# EAGLE design pink-0 (EAGLE 7.3.0)
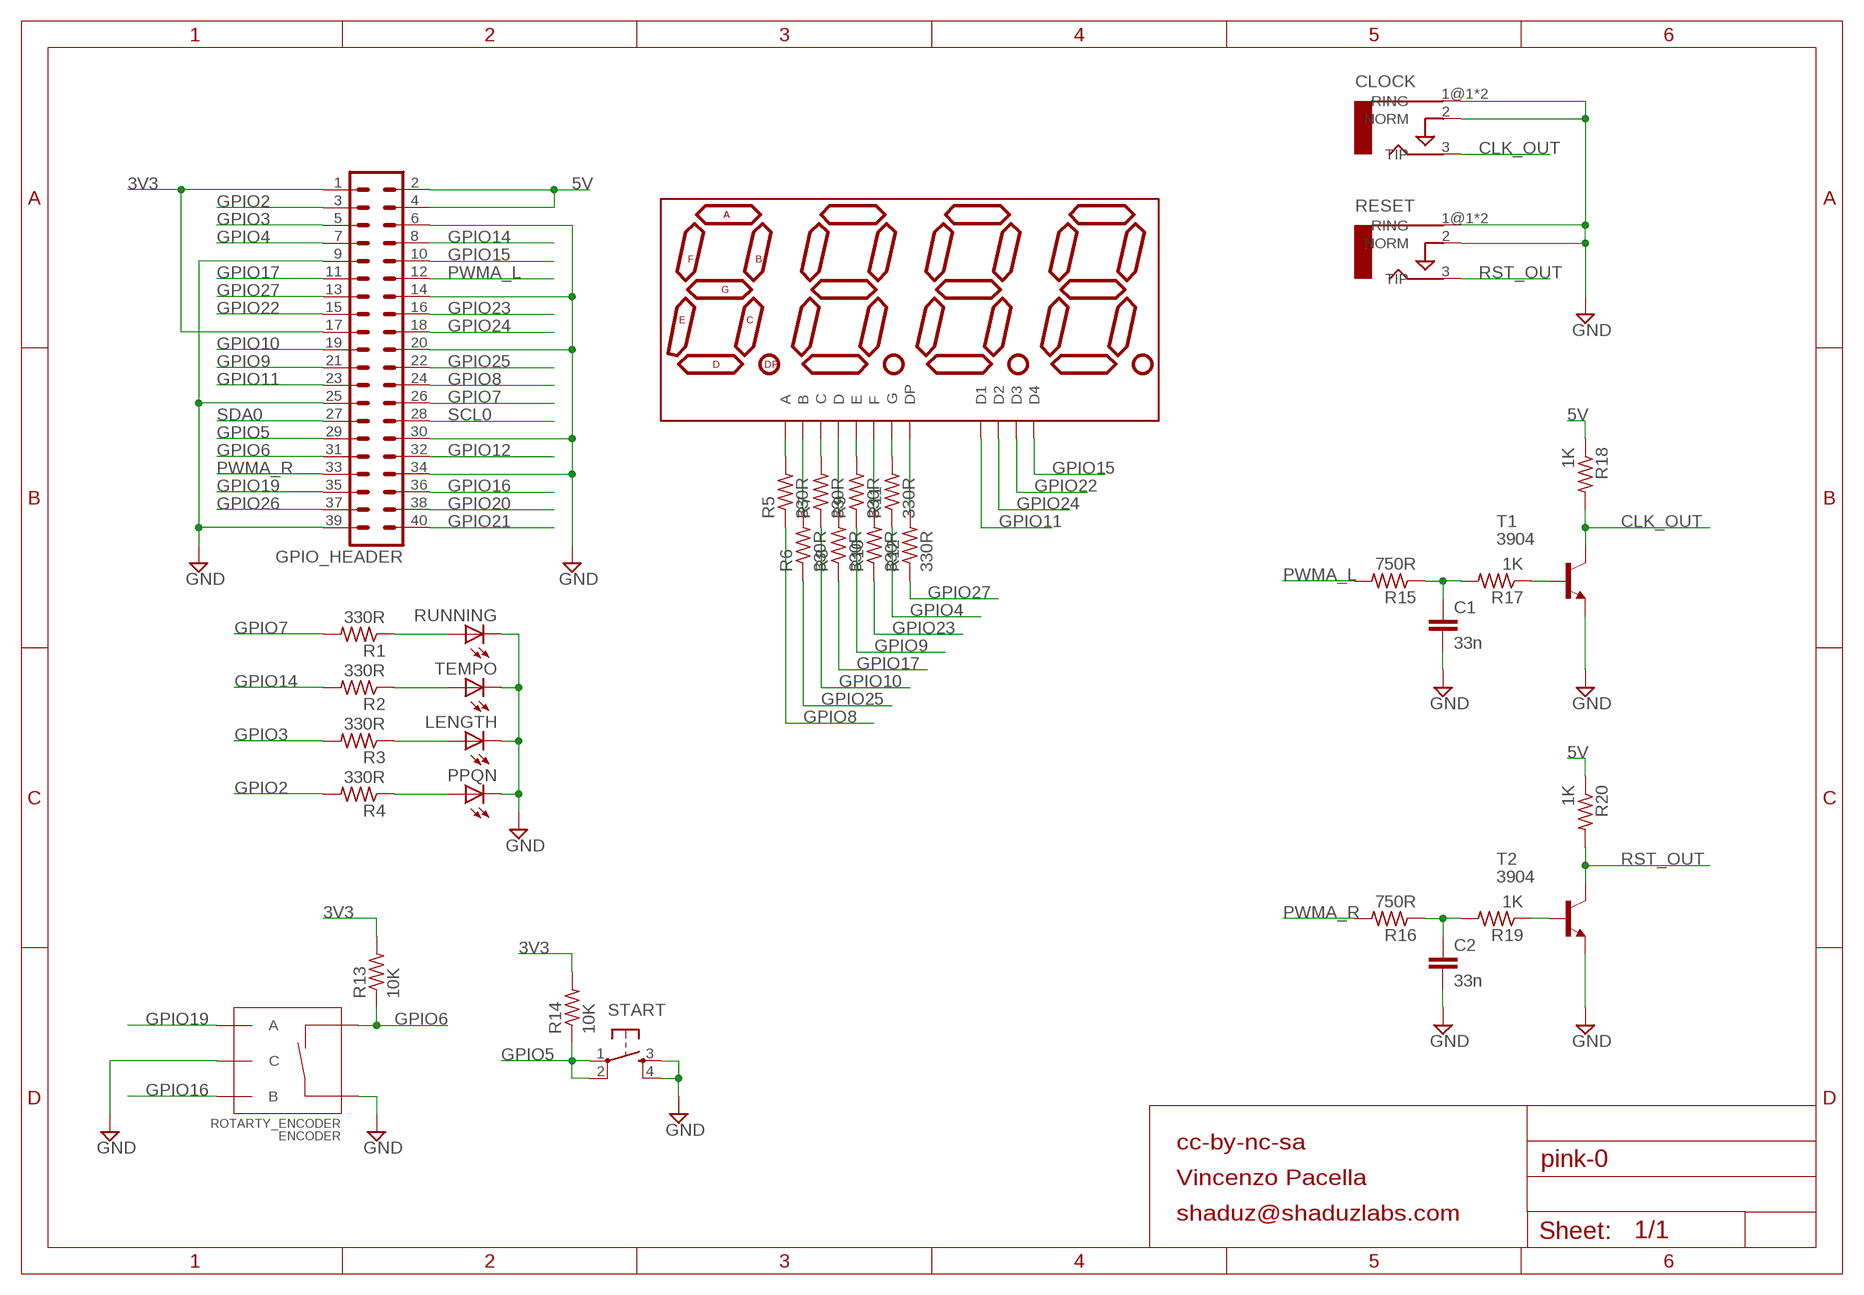
[diagram p0: schematic, sheet 1]

## Parts
C1  33n  CAP0603-CAP  [0603-CAP]
C2  33n  CAP0603-CAP  [0603-CAP]
CLOCK  AUDIO-JACKERTHENVAR  [ERTHENVAR-JACK]
DISP1  QDSP6064  7-SEGMENT-4DIGIT-COUNTER-HP-BUBBLE  [DIL12]
ENCODER  ROTARTY_ENCODER  [ROTARY_ENC_PLAIN]
GPIO_HEADER  PIZERO_THROUGH_HOLE  [PIZERO_THOUGH_HOLE]
LENGTH  LED0603  [LED-0603]
PPQN  LED0603  [LED-0603]
R1  330R  R-US_R0402  [R0402]
R2  330R  R-US_R0402  [R0402]
R3  330R  R-US_R0402  [R0402]
R4  330R  R-US_R0402  [R0402]
R5  330R  R-US_R0402  [R0402]
R6  330R  R-US_R0402  [R0402]
R7  330R  R-US_R0402  [R0402]
R8  330R  R-US_R0402  [R0402]
R9  330R  R-US_R0402  [R0402]
R10  330R  R-US_R0402  [R0402]
R11  330R  R-US_R0402  [R0402]
R12  330R  R-US_R0402  [R0402]
R13  10K  R-US_R0402  [R0402]
R14  10K  R-US_R0402  [R0402]
R15  750R  R-US_R0402  [R0402]
R16  750R  R-US_R0402  [R0402]
R17  1K  R-US_R0402  [R0402]
R18  1K  R-US_R0402  [R0402]
R19  1K  R-US_R0402  [R0402]
R20  1K  R-US_R0402  [R0402]
RESET  AUDIO-JACKERTHENVAR  [ERTHENVAR-JACK]
RUNNING  LED0603  [LED-0603]
START  TAC_SWITCHPTH  [TACTILE-PTH]
T1  3904  MMBT3904LT1-NPN-SOT23-BEC  [SOT23-BEC]
T2  3904  MMBT3904LT1-NPN-SOT23-BEC  [SOT23-BEC]
TEMPO  LED0603  [LED-0603]

## Nets
3V3: GPIO_HEADER.1 GPIO_HEADER.17 R13.2 R14.2
5V: GPIO_HEADER.2 GPIO_HEADER.4 R18.1 R20.1
CLK_OUT: CLOCK.3(TIP) R18.2 T1.C
GND: C1.2 C2.2 CLOCK.1@1(RING) CLOCK.1@2(RING) CLOCK.2(NORM) ENCODER.C ENCODER.SW+ GPIO_HEADER.6 GPIO_HEADER.9 GPIO_HEADER.14 GPIO_HEADER.20 GPIO_HEADER.25 GPIO_HEADER.30 GPIO_HEADER.34 GPIO_HEADER.39 LENGTH.C PPQN.C RESET.1@1(RING) RESET.1@2(RING) RESET.2(NORM) RUNNING.C START.3 START.4 T1.E T2.E TEMPO.C
GPIO2: GPIO_HEADER.3 R4.2
GPIO3: GPIO_HEADER.5 R3.2
GPIO4: GPIO_HEADER.7 R11.1
GPIO5: GPIO_HEADER.29 R14.1 START.1 START.2
GPIO6: ENCODER.SW- GPIO_HEADER.31 R13.1
GPIO7: GPIO_HEADER.26 R1.2
GPIO8: GPIO_HEADER.24 R5.1
GPIO9: GPIO_HEADER.21 R9.1
GPIO10: GPIO_HEADER.19 R7.1
GPIO11: DISP1.1(D1) GPIO_HEADER.23
GPIO12: GPIO_HEADER.32
GPIO14: GPIO_HEADER.8 R2.2
GPIO15: DISP1.6(D4) GPIO_HEADER.10
GPIO16: ENCODER.B GPIO_HEADER.36
GPIO17: GPIO_HEADER.11 R8.1
GPIO19: ENCODER.A GPIO_HEADER.35
GPIO20: GPIO_HEADER.38
GPIO21: GPIO_HEADER.40
GPIO22: DISP1.4(D3) GPIO_HEADER.15
GPIO23: GPIO_HEADER.16 R10.1
GPIO24: DISP1.10(D2) GPIO_HEADER.18
GPIO25: GPIO_HEADER.22 R6.1
GPIO26: GPIO_HEADER.37
GPIO27: GPIO_HEADER.13 R12.1
N$1: DISP1.12(A) R5.2
N$2: DISP1.11(B) R6.2
N$3: DISP1.3(C) R7.2
N$4: DISP1.8(D) R8.2
N$5: R1.1 RUNNING.A
N$6: R2.1 TEMPO.A
N$7: DISP1.2(E) R9.2
N$8: DISP1.9(F) R10.2
N$9: DISP1.7(G) R11.2
N$10: DISP1.5(DP) R12.2
N$13: R19.1 T2.B
N$14: R17.1 T1.B
N$25: C1.1 R15.1 R17.2
N$26: LENGTH.A R3.1
N$27: PPQN.A R4.1
N$32: C2.1 R16.1 R19.2
PWMA_L: GPIO_HEADER.12 R15.2
PWMA_R: GPIO_HEADER.33 R16.2
RST_OUT: R20.2 RESET.3(TIP) T2.C
SCL0: GPIO_HEADER.28
SDA0: GPIO_HEADER.27

## Notes on the sheet
- cc-by-nc-sa
- Vincenzo Pacella
- shaduz@shaduzlabs.com

## Library data of the parts
C1 C2 = SparkFun-Capacitors:CAP: Capacitor Standard 0603 ceramic capacitor, and 0.1" leaded capacitor.
CLOCK RESET = erthenvar:AUDIO-JACK: Switching Mono 3.5mm Audio Jack from Erthenvar.
DISP1 = SparkFun-Displays:7-SEGMENT-4DIGIT-COUNTER; STOREFRONT: COM-12710
ENCODER = SparkFun-Electromechanical:ROTARTY_ENCODER: Simple no LED rotary encoder Example: COM-09117
GPIO_HEADER = pizero:PIZERO_THROUGH_HOLE
LENGTH PPQN RUNNING TEMPO = SparkFun-LED:LED: LEDs Standard schematic elements and footprints for 5mm, 3mm, 1206, and 0603 sized LEDs. 5mm - Spark Fun Electronics SKU : COM-00529 (and others)
R1-R20 = resistor:R-US_: RESISTOR, American symbol
START = SparkFun-Electromechanical:TAC_SWITCH: Momentary Switch Button commonly used for reset or general input. Spark Fun Electronics SKU : COM-00097 SMT- SWCH-08247
T1 T2 = transistor:*-NPN-: NPN Transistror BF959 corrected 2008.03.06

## Board
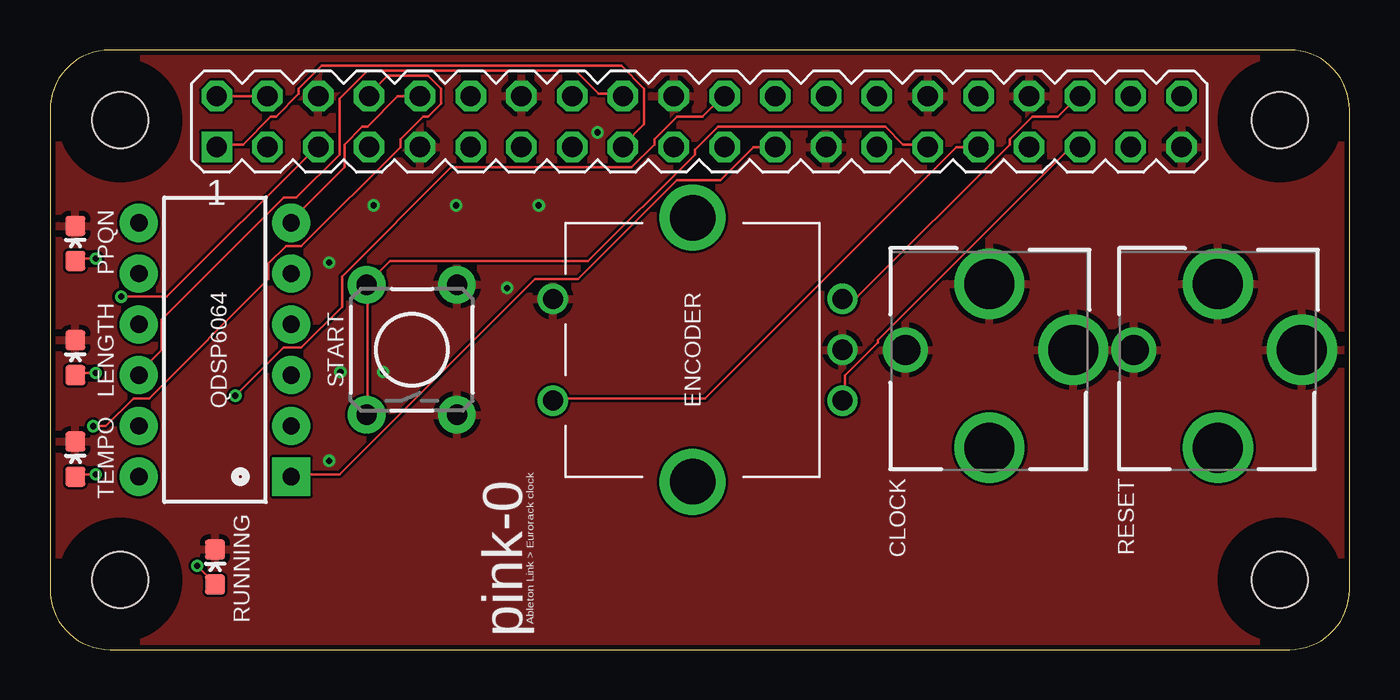
[diagram p1: board, top side]
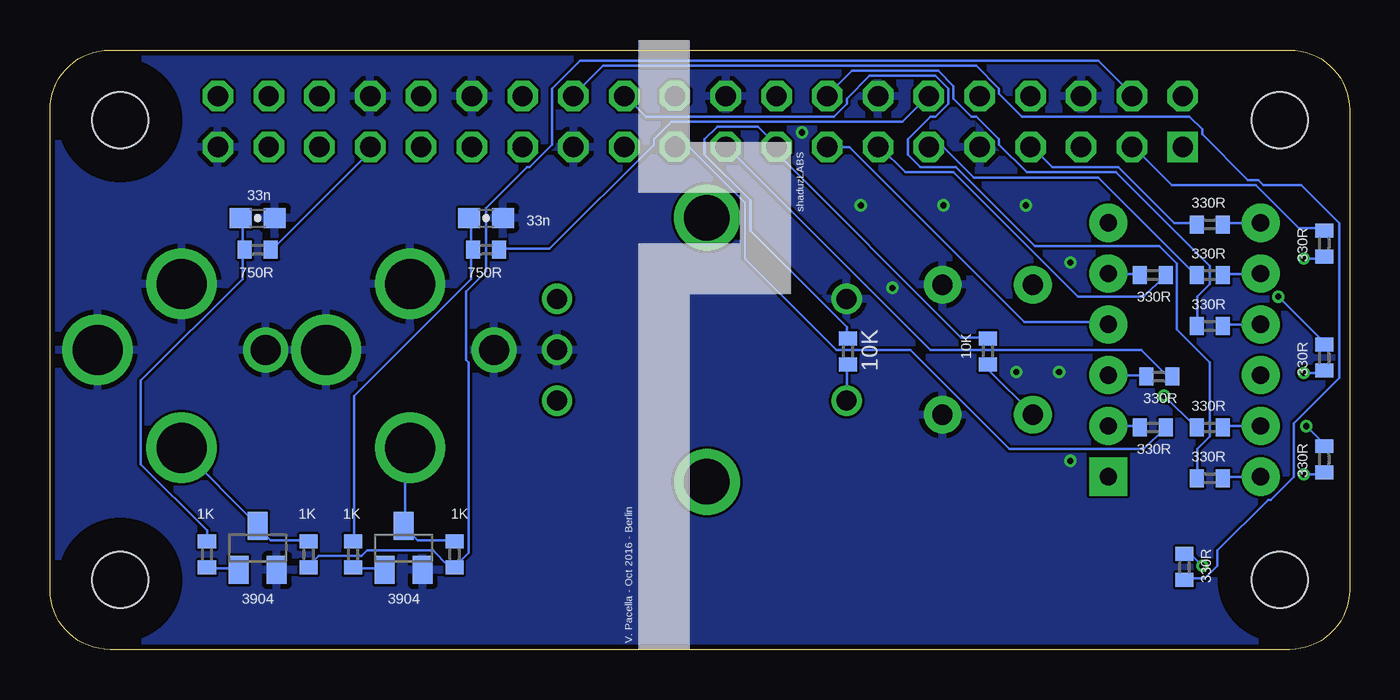
[diagram p2: board, bottom side, seen from below]

Size 65 x 30 mm. Coordinates in mm from the lower left corner, seen from the top.
Copper layers (1*16): Top 0.035mm / dielectric 1.5mm / Bottom 0.035mm
Design rules "MF_Standard_2_Layer": minimum track width 5mil, minimum drill 12mil, track to track 5mil, track to pad 5mil, pad to pad 5mil, via to via 5mil, smd to smd 0mil, copper to edge 10mil, drill to drill 10mil, minimum pad ring 6mil, minimum via ring 6mil, stop-mask expansion 2mil, vias tented up to drill 25mil, thermal gap 10mil

### Footprints (pad centres in the part's own frame; a part is rotated, then mirrored left to right if it is on the bottom)
0603-CAP = smd 1.1 x 1: 1 -0.85,0; 2 0.85,0
ERTHENVAR-JACK = drill 2.5: 1@1 -4.2,0; 2 0,-3.3; 3 0,4.9 | drill 1.5: 1@2 4.2,0
DIL12 = drill 0.864 pad 1.905 square: 1 -6.35,-3.81 | drill 0.864 pad 1.905: 2 -3.81,-3.81; 3 -1.27,-3.81; 4 1.27,-3.81; 5 3.81,-3.81; 6 6.35,-3.81; 7 6.35,3.81; 8 3.81,3.81; 9 1.27,3.81; 10 -1.27,3.81; 11 -3.81,3.81; 12 -6.35,3.81
ROTARY_ENC_PLAIN = drill 1.016: A 7.493,-2.54; B 7.493,2.54; C 7.493,0; SW+ -6.985,2.54; SW- -6.985,-2.54 | drill 2.286: P$3 0,6.604; P$4 0,-6.604
PIZERO_THOUGH_HOLE = drill 1.016 square: 1 8.34,25.15 | drill 1.016 octagon: 2 8.34,27.69; 3 10.88,25.15; 4 10.88,27.69; 5 13.42,25.15; 6 13.42,27.69; 7 15.96,25.15; 8 15.96,27.69; 9 18.5,25.15; 10 18.5,27.69; 11 21.04,25.15; 12 21.04,27.69; 13 23.58,25.15; 14 23.58,27.69; 15 26.12,25.15; 16 26.12,27.69; 17 28.66,25.15; 18 28.66,27.69; 19 31.2,25.15; 20 31.2,27.69; 21 33.74,25.15; 22 33.74,27.69; 23 36.28,25.15; 24 36.28,27.69; 25 38.82,25.15; 26 38.82,27.69; 27 41.36,25.15; 28 41.36,27.69; 29 43.9,25.15; 30 43.9,27.69; 31 46.44,25.15; 32 46.44,27.69; 33 48.98,25.15; 34 48.98,27.69; 35 51.52,25.15; 36 51.52,27.69; 37 54.06,25.15; 38 54.06,27.69; 39 56.6,25.15; 40 56.6,27.69 | hole 2.8: 3.5,3.5; 3.5,26.5; 61.5,26.5; 61.5,3.5
LED-0603 = smd 1 x 1: A 0,-0.877; C 0,0.877
R0402 = smd 0.7 x 0.9: 1 -0.65,0; 2 0.65,0
TACTILE-PTH = drill 1.016 pad 1.88: 1 -3.251,2.261; 2 3.251,2.261; 3 -3.251,-2.261; 4 3.251,-2.261
SOT23-BEC = smd 1 x 1.4: B -0.95,-1.1; C 0,1.1; E 0.95,-1.1

### Placement (x,y rotation side)
C1  43.18,21.59 0 bottom
C2  54.61,21.59 0 bottom
CLOCK  46.99,15 180 top
DISP1  8.26,15 90 top
ENCODER  32.14,15 0 top
GPIO_HEADER  0,0 0 top
LENGTH  1.27,14.61 0 top
PPQN  1.27,20.32 0 top
R1  8.26,4.13 270 bottom
R2  1.27,9.53 90 bottom
R3  1.27,14.61 90 bottom
R4  1.27,20.32 90 bottom
R5  6.99,8.57 0 bottom
R6  6.99,11.11 0 bottom
R7  9.53,13.65 180 bottom
R8  6.99,18.73 0 bottom
R9  9.84,11.11 180 bottom
R10  6.99,16.19 0 bottom
R11  6.99,21.27 0 bottom
R12  9.84,18.73 180 bottom
R13  25.08,14.92 90 bottom
R14  18.1,14.92 90 bottom
R15  43.18,20 0 bottom
R16  54.61,20 0 bottom
R17  49.85,4.76 90 bottom
R18  44.77,4.76 90 bottom
R19  57.15,4.76 90 bottom
R20  52.07,4.76 90 bottom
RESET  58.42,15 180 top
RUNNING  8.26,4.13 0 top
START  18.1,15 90 top
T1  47.31,5.08 0 bottom
T2  54.61,5.08 0 bottom
TEMPO  1.27,9.53 0 top

### Tracks (layer width: path | path; a pad name or v marks a point on that pad's centre or on a via)
3V3
  Top 0.127: GPIO_HEADER.1 8.38,25.27 9.65,25.27 11.05,26.67 11.3,26.67 12.45,27.81 12.45,28.07 13.59,29.21 28.57,29.21 29.72,28.07 29.72,26.29 28.7,25.27 GPIO_HEADER.17
  Bottom 0.127: R14.2 18.16,15.62 19.43,15.62 28.57,24.77 28.57,25.15 GPIO_HEADER.17 28.7,25.27 29.59,26.16 31.62,26.16 32.26,25.53 32.26,24.77 29.97,22.48 29.97,20.95 25.15,16.13 25.15,15.62 R13.2
5V
  Top 0.127: GPIO_HEADER.2 8.38,27.69 10.79,27.69 GPIO_HEADER.4
  Bottom 0.127: R20.1 52.07,4.19 51.56,4.7 49.4,4.7 49.15,4.95 45.85,4.95 45.09,4.19 44.83,4.19 R18.1 44.7,4.19 44.07,4.83 44.07,14.35 44.2,14.48 44.2,17.91 43.18,18.92 43.18,22.1 41.15,24.13 41.02,24.13 39.88,25.27 39.88,28.07 38.48,29.46 12.57,29.46 10.92,27.81 GPIO_HEADER.4
CLK_OUT
  Bottom 0.127: R18.2 44.83,5.46 46.61,5.46 47.24,6.1 T1.C 47.24,6.22 47.24,9.78 46.99,10.03 CLOCK.3
GND  (via drill 0.3)
  other vias: 27.38,25.88 24.45,22.23 20.32,22.23 13.97,19.37 16.19,22.23 22.86,18.1 13.97,9.45 16.67,13.89 14.53,13.89
  pour Bottom: 0,0 0,30.48 64.77,30.48 64.77,0
  pour Top: 0,0 0,30.48 64.77,30.48 64.77,0
GPIO2
  Bottom 0.127: R4.2 1.27,21.08 2.54,21.08 4.7,23.24 8.89,23.24 10.79,25.15 GPIO_HEADER.3
GPIO3  (via drill 0.3)
  Top 0.127: v3.56,17.65 5.84,17.65 13.34,25.15 GPIO_HEADER.5
  Bottom 0.127: v3.56,17.65 1.27,15.37 R3.2
GPIO4
  Bottom 0.127: R11.1 7.75,21.34 8.76,21.34 11.56,24.13 14.86,24.13 15.88,25.15 GPIO_HEADER.7
GPIO5
  Top 0.127: GPIO_HEADER.29 43.81,25.27 42.67,25.27 41.78,26.16 33.4,26.16 32.26,25.02 32.26,24.77 26.92,19.43 17.02,19.43 15.88,18.29 START.2 15.88,18.16 15.88,11.81 START.1
  Bottom 0.127: R14.1 18.03,14.22 18.03,13.97 15.88,11.81 START.1
GPIO6
  Top 0.127: GPIO_HEADER.31 46.35,25.15 45.34,25.15 32.77,12.57 25.27,12.57 ENCODER.SW-
  Bottom 0.127: R13.1 25.15,14.22 25.15,12.57 ENCODER.SW-
GPIO7
  Bottom 0.127: R1.2 8.26,3.56 7.24,3.56 6.6,4.19 6.6,4.95 4.06,7.49 3.94,7.49 2.79,8.64 2.79,11.3 0.51,13.59 0.51,21.34 2.41,23.24 4.32,23.24 4.57,23.5 5.08,23.5 7.37,25.78 7.37,26.04 8,26.67 16.38,26.67 17.53,27.81 17.53,28.07 18.67,29.21 37.34,29.21 38.73,27.81 GPIO_HEADER.26
GPIO8
  Bottom 0.127: R5.1 7.62,8.64 7.62,10.03 6.99,10.67 6.99,14.35 8.64,16 8.64,19.3 9.53,20.19 15.75,20.19 19.68,24.13 21.46,24.13 22.1,24.77 22.1,25.53 20.95,26.67 20.7,26.67 20.07,27.3 20.07,28.07 20.7,28.7 24,28.7 25.15,27.56 25.15,27.3 25.78,26.67 35.18,26.67 36.2,27.69 GPIO_HEADER.24
GPIO9
  Bottom 0.127: R9.1 9.27,11.05 10.29,10.03 17.02,10.03 21.97,14.99 25.65,14.99 30.23,19.56 30.23,22.35 33.02,25.15 33.66,25.15 GPIO_HEADER.21
GPIO10
  Bottom 0.127: R7.1 8.89,13.72 9.14,13.72 10.41,14.99 20.95,14.99 31.11,25.15 GPIO_HEADER.19
GPIO11
  Top 0.127: GPIO_HEADER.23 36.2,25.15 35.18,25.15 33.53,23.5 31.37,23.5 26.42,18.54 24.26,18.54 14.48,8.76 12.06,8.76 DISP1.1
GPIO14  (via drill 0.3)
  Top 0.127: v2.16,11.18 2.79,11.18 4.19,12.57 4.95,12.57 10.92,18.54 10.92,19.3 11.81,20.19 12.57,20.19 17.53,25.15 17.53,25.53 18.67,26.67 18.92,26.67 19.56,27.3 19.56,28.07 18.92,28.7 16.89,28.7 16,27.81 GPIO_HEADER.8
  Bottom 0.127: v2.16,11.18 1.27,10.29 R2.2
GPIO15
  Top 0.127: GPIO_HEADER.10 18.41,27.69 17.4,27.69 15.88,26.16 15.62,26.16 14.73,25.27 14.73,24.13 12.06,21.46 DISP1.6
GPIO16
  Top 0.127: ENCODER.B 39.75,17.65 40.39,17.65 48.01,25.27 48.01,25.53 49.15,26.67 50.42,26.67 51.44,27.69 GPIO_HEADER.36
GPIO17
  Bottom 0.127: R8.1 7.75,18.8 12.57,23.62 18.8,23.62 20.32,25.15 20.95,25.15 GPIO_HEADER.11
GPIO19
  Top 0.127: ENCODER.A 39.75,12.57 39.75,13.72 41.4,15.37 41.4,15.49 51.05,25.15 51.44,25.15 GPIO_HEADER.35
GPIO22
  Bottom 0.127: GPIO_HEADER.15 26.04,25.15 25.02,25.15 16.26,16.38 12.06,16.38 DISP1.4
GPIO23
  Bottom 0.127: R10.1 7.62,16.26 7.62,17.65 6.99,18.29 6.99,19.18 11.68,23.88 16.13,23.88 17.53,25.27 17.53,25.53 18.67,26.67 18.92,26.67 19.81,27.56 19.81,28.19 20.57,28.96 24.89,28.96 26.04,27.81 GPIO_HEADER.16
GPIO24
  Top 0.127: GPIO_HEADER.18 28.57,27.81 27.43,27.81 26.29,28.96 15.88,28.96 14.48,27.56 14.48,24.77 12.32,22.61 11.68,22.61 5.59,16.51 5.59,14.99 4.45,13.84 DISP1.10
GPIO25  (via drill 0.3)
  Top 0.127: v9.27,12.7 11.68,15.11 12.57,15.11 14.61,17.14 14.61,18.67 20.07,24.13 29.08,24.13 30.23,25.27 30.23,25.53 31.37,26.67 32.64,26.67 33.66,27.69 GPIO_HEADER.22
  Bottom 0.127: v9.27,12.7 7.75,11.18 R6.1
GPIO27
  Bottom 0.127: R12.1 9.27,18.67 10.29,17.65 13.59,17.65 19.81,23.88 22.23,23.88 23.5,25.15 GPIO_HEADER.13
N$1
  Bottom 0.127: R5.2 6.22,8.64 4.45,8.64 DISP1.12
N$2
  Bottom 0.127: R6.2 6.22,11.18 4.45,11.18 DISP1.11
N$3
  Bottom 0.127: R7.2 10.29,13.72 12.06,13.72 DISP1.3
N$4
  Bottom 0.127: R8.2 6.22,18.8 4.45,18.8 DISP1.8
N$5  (via drill 0.3)
  Top 0.127: v7.37,4.19 8.26,3.3 RUNNING.A
  Bottom 0.127: v7.37,4.19 7.87,4.7 8.26,4.7 R1.1
N$6  (via drill 0.3)
  Top 0.127: v2.29,8.76 1.27,8.76 TEMPO.A
  Bottom 0.127: v2.29,8.76 1.27,8.76 R2.1
N$7
  Bottom 0.127: R9.2 10.54,11.18 12.06,11.18 DISP1.2
N$8
  Bottom 0.127: R10.2 6.22,16.26 4.45,16.26 DISP1.9
N$9
  Bottom 0.127: R11.2 6.22,21.34 4.45,21.34 DISP1.7
N$10
  Bottom 0.127: R12.2 10.54,18.8 12.06,18.8 DISP1.5
N$13
  Bottom 0.127: R19.1 57.15,4.06 55.63,4.06 T2.B
N$14
  Bottom 0.127: R17.1 49.78,4.06 48.26,4.06 T1.B
N$25
  Bottom 0.127: C1.1 43.94,21.59 43.94,20.07 R15.1 43.94,19.94 43.94,18.54 49.78,12.7 49.78,5.46 R17.2
N$26  (via drill 0.3)
  Top 0.127: v2.29,13.84 1.27,13.84 LENGTH.A
  Bottom 0.127: v2.29,13.84 1.27,13.84 R3.1
N$27  (via drill 0.3)
  Top 0.127: v2.29,19.56 1.27,19.56 PPQN.A
  Bottom 0.127: v2.29,19.56 1.27,19.56 R4.1
N$32
  Bottom 0.127: C2.1 55.37,21.59 55.37,20.07 R16.1 55.37,19.94 55.37,18.54 60.45,13.46 60.45,9.27 57.15,5.97 R19.2
PWMA_L
  Bottom 0.127: R15.2 42.42,20.07 40.01,20.07 34.8,25.27 34.8,25.53 33.91,26.42 22.35,26.42 21.08,27.69 GPIO_HEADER.12
PWMA_R
  Bottom 0.127: R16.2 53.85,20.07 49.02,24.89 49.02,25.15 GPIO_HEADER.33
RST_OUT
  Bottom 0.127: R20.2 52.07,5.46 53.98,5.46 54.61,6.1 T2.C 54.61,6.22 58.42,10.03 RESET.3

### Text on the board
tNames: pink-0 | Ableton Link > Eurorack clock
bNames: shaduzLABS | V. Pacella - Oct 2016 - Berlin